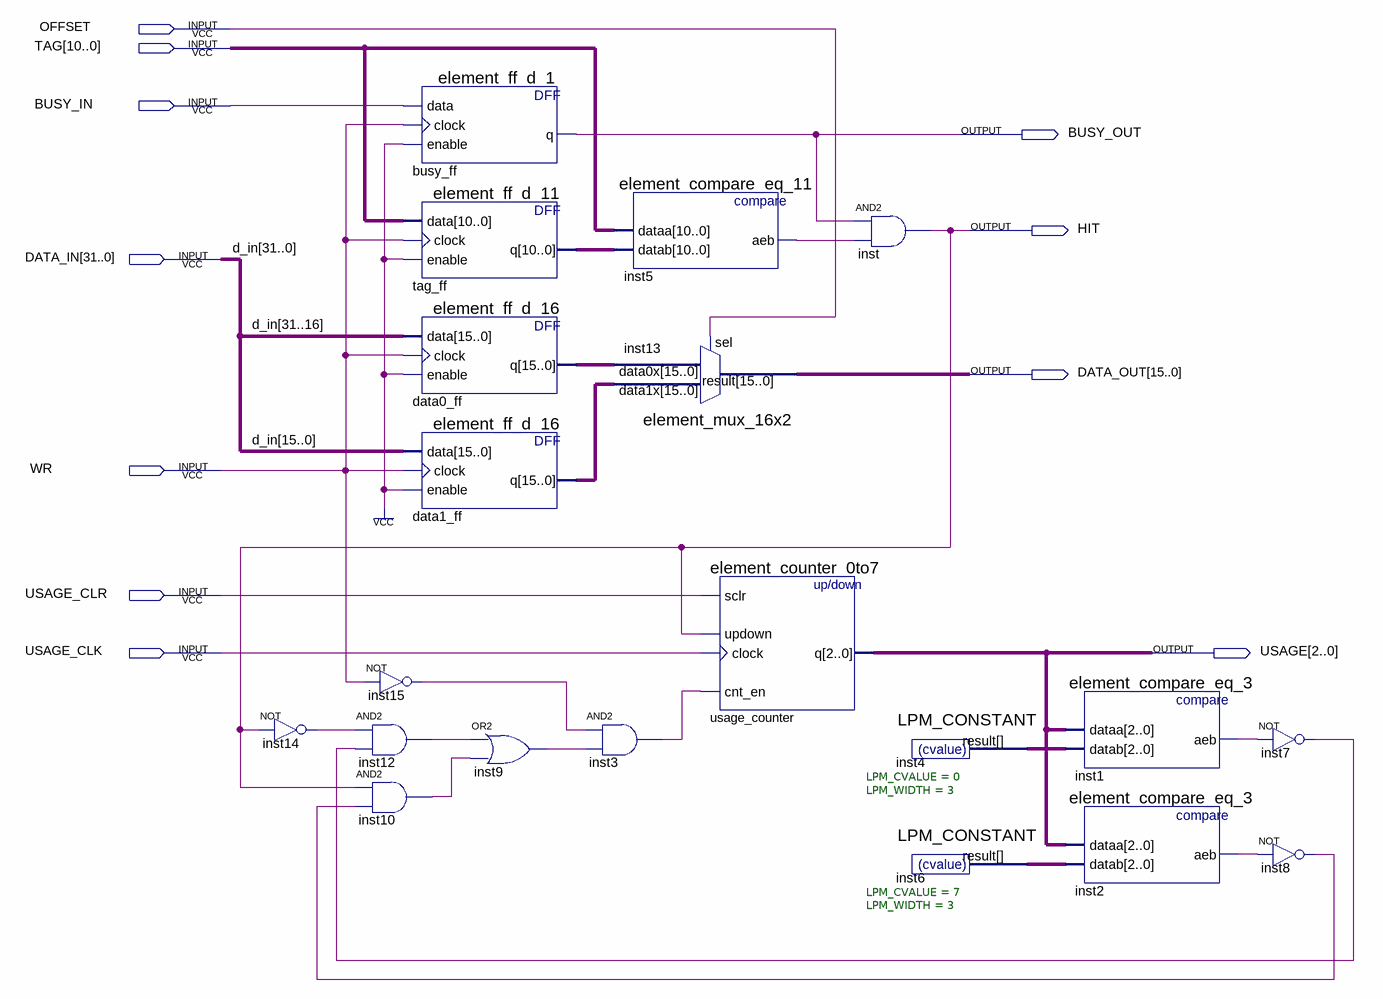
[diagram p0: schematic sheet]
// Quartus schematic block-cache-entry.bdf as structural Verilog: 20 symbols, 11 pins
module \block-cache-entry  (
  input  OFFSET,
  input  [10:0] TAG,
  input  BUSY_IN,
  input  [31:0] DATA_IN,
  input  WR,
  input  USAGE_CLR,
  input  USAGE_CLK,
  output BUSY_OUT,
  output HIT,
  output [15:0] DATA_OUT,
  output [2:0] USAGE
);

  wire inst1_aeb, inst2_aeb, inst3_out, inst5_aeb, inst7_out, inst8_out, inst9_out, inst10_out, inst12_out,
       inst14_out, inst15_out;
  wire [2:0] inst4_result, inst6_result;
  wire [10:0] tag_ff_q;
  wire [15:0] data0_ff_q, data1_ff_q;

  not inst14 (inst14_out, HIT);
  not inst15 (inst15_out, WR);
  and inst12 (inst12_out, inst14_out, inst7_out);
  and inst10 (inst10_out, HIT, inst8_out);
  element_ff_d_1 busy_ff (.data(BUSY_IN), .clock(WR), .enable(1'b1), .q(BUSY_OUT));
  element_ff_d_11 tag_ff (.data(TAG), .clock(WR), .enable(1'b1), .q(tag_ff_q));
  element_ff_d_16 data0_ff (.data(DATA_IN[31:16]), .clock(WR), .enable(1'b1), .q(data0_ff_q));
  element_ff_d_16 data1_ff (.data(DATA_IN[15:0]), .clock(WR), .enable(1'b1), .q(data1_ff_q));
  or inst9 (inst9_out, inst12_out, inst10_out);
  and inst3 (inst3_out, inst15_out, inst9_out);
  element_compare_eq_11 inst5 (.dataa(TAG), .datab(tag_ff_q), .aeb(inst5_aeb));
  element_mux_16x2 inst13 (.data1x(data1_ff_q), .data0x(data0_ff_q), .sel(OFFSET), .result(DATA_OUT));
  element_counter_0to7 usage_counter (.sclr(USAGE_CLR), .updown(HIT), .clock(USAGE_CLK), .cnt_en(inst3_out), .q(USAGE));
  and inst (HIT, BUSY_OUT, inst5_aeb);
  LPM_CONSTANT #(.LPM_CVALUE(0), .LPM_WIDTH(3)) inst4 (.result(inst4_result));
  LPM_CONSTANT #(.LPM_CVALUE(7), .LPM_WIDTH(3)) inst6 (.result(inst6_result));
  element_compare_eq_3 inst1 (.dataa(USAGE), .datab(inst4_result), .aeb(inst1_aeb));
  element_compare_eq_3 inst2 (.dataa(USAGE), .datab(inst6_result), .aeb(inst2_aeb));
  not inst7 (inst7_out, inst1_aeb);
  not inst8 (inst8_out, inst2_aeb);

  // Other names for the same wires on the sheet: d_in[31:0] = DATA_IN
endmodule
